# EAGLE design arduino-isp (EAGLE 7.7.0)
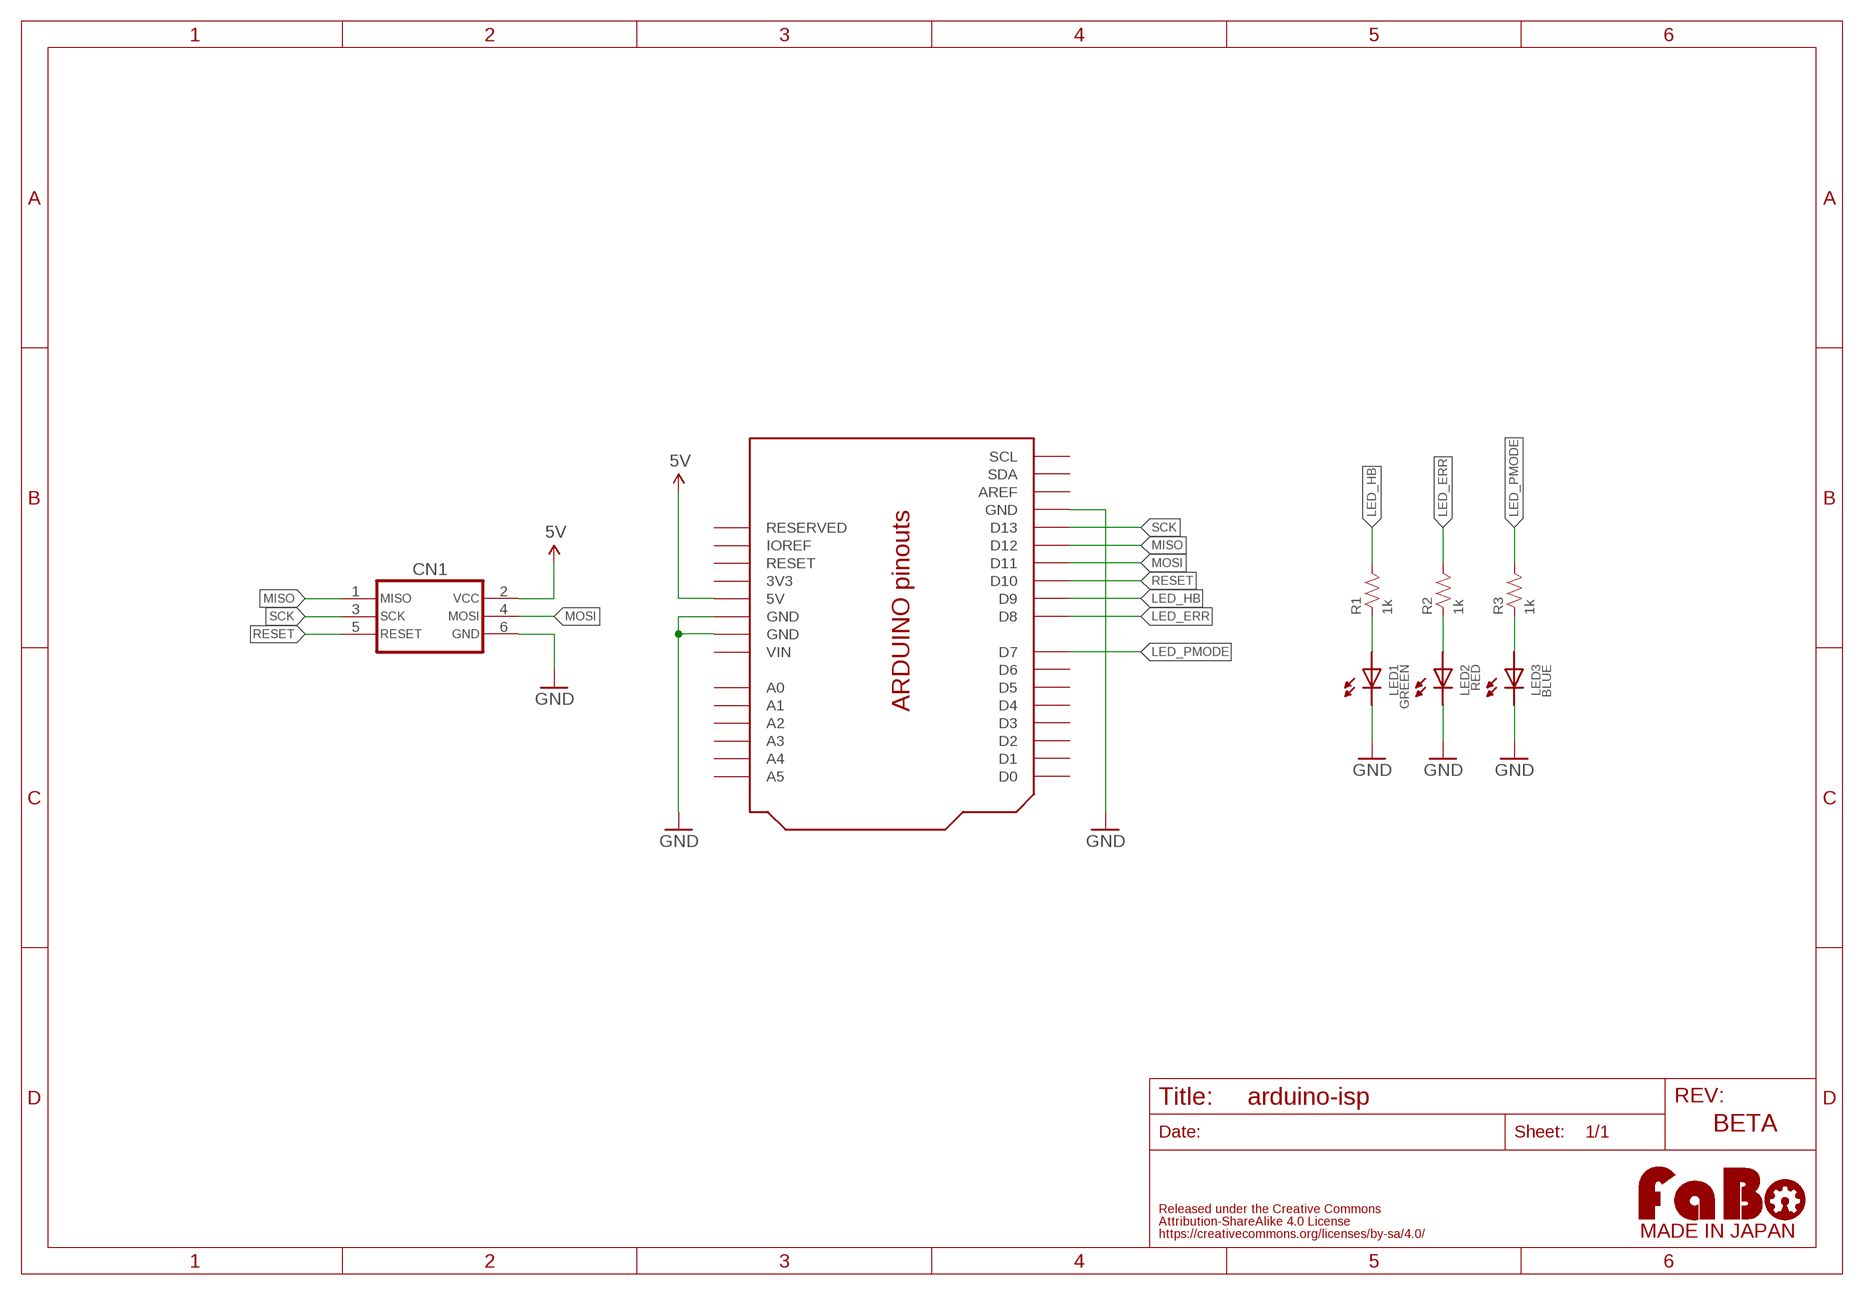
[diagram p0: schematic, sheet 1]

## Parts
CN1  AVR_ISP_BOX  [BOX_2X3]
LED1  GREEN  LED-5MM  [LED_5MM]
LED2  RED  LED-5MM  [LED_5MM]
LED3  BLUE  LED-5MM  [LED_5MM]
R1  1k  RESISTOR-AXL-REGULAR  [AXL-REGULAR]
R2  1k  RESISTOR-AXL-REGULAR  [AXL-REGULAR]
R3  1k  RESISTOR-AXL-REGULAR  [AXL-REGULAR]
U1  ARDUINO_UNO_R3_SHIELD-HALF  [ARDUINO_SHIELD_HALF]
U$2  LOGO_FABO-M  [LOGO_FABO_MS]

## Nets
5V: CN1.2 U1.5V
GND: CN1.6 LED1.K(CATHODE) LED2.K(CATHODE) LED3.K(CATHODE) U1.GND1(GND) U1.GND2(GND) U1.GND3(GND)
LED_ERR: R2.2 U1.D8
LED_HB: R1.2 U1.D9
LED_PMODE: R3.2 U1.D7
MISO: CN1.1 U1.D12
MOSI: CN1.4 U1.D11
N$2: LED1.A(ANODE) R1.1
N$4: LED2.A(ANODE) R2.1
N$6: LED3.A(ANODE) R3.1
RESET: CN1.5 U1.D10
SCK: CN1.3 U1.D13
Unconnected: U1.A0 U1.A1 U1.A2 U1.A3 U1.A4 U1.A5 U1.AREF U1.D0 U1.D1 U1.D2 U1.D3 U1.D4 U1.D5 U1.D6 U1.IOREF U1.RESERVED U1.RESET U1.SCL U1.SDA

## Notes on the sheet
- BETA

## Power pins joined to a net without a drawn wire
3V3: U1.3V3
VIN: U1.VIN

## Library data of the parts
CN1 = FaBo-PIN:AVR_ISP_BOX
LED1-LED3 = FaBo-LED:LED
R1-R3 = FaBo-Resistors:RESISTOR: RESISTOR
U1 = FaBo-Boards:ARDUINO_UNO_R3_SHIELD
U$2 = FaBo-Logo:LOGO_FABO

## Board
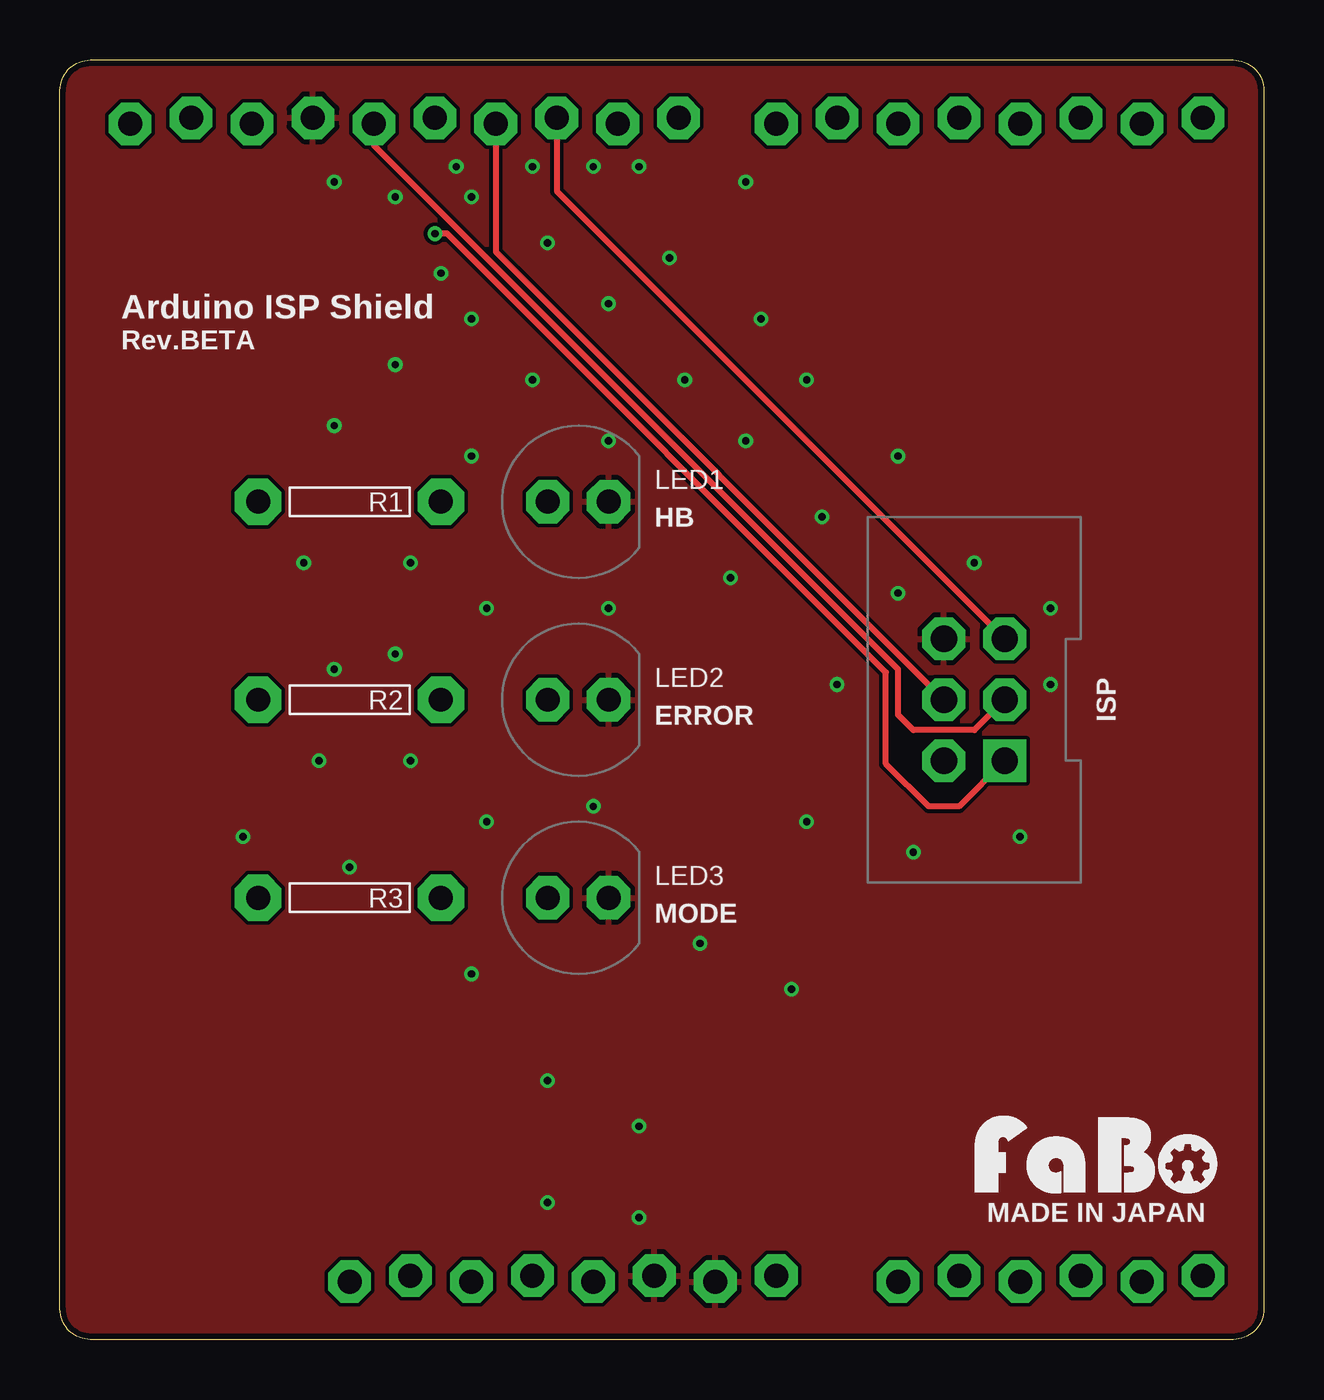
[diagram p1: board, top side]
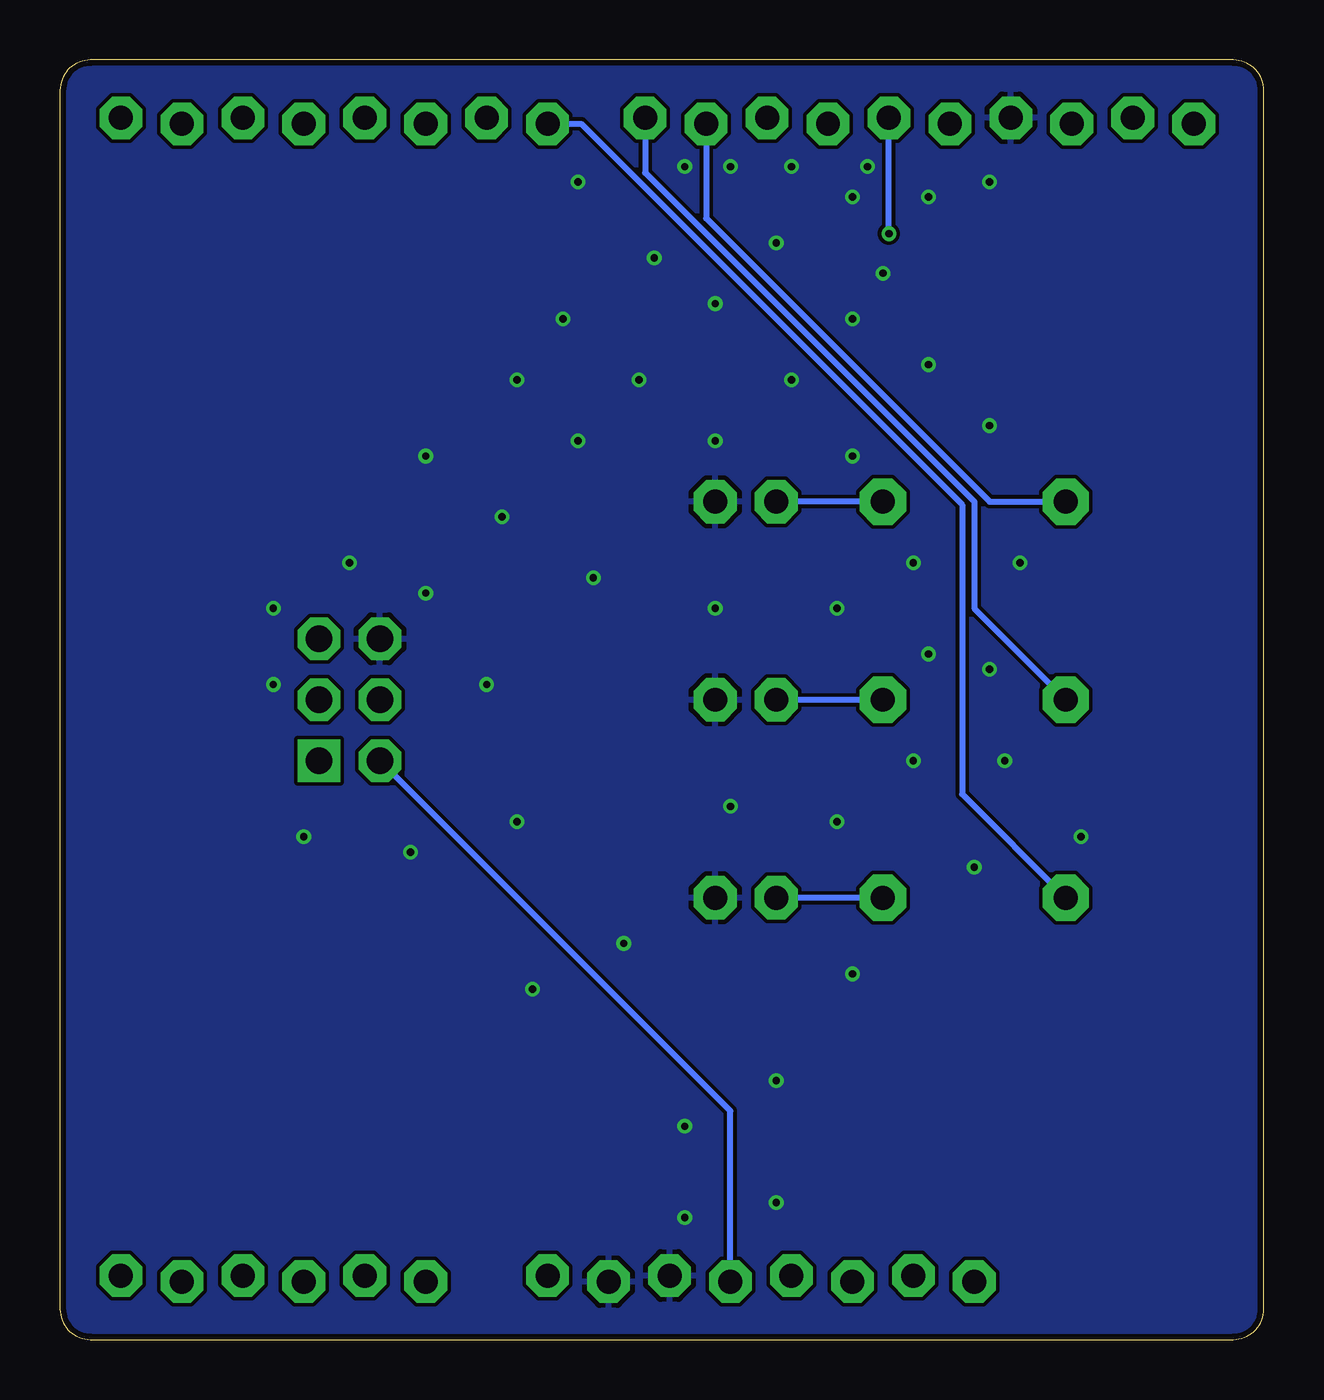
[diagram p2: board, bottom side, seen from below]

Size 50.16 x 53.34 mm. Coordinates in mm from the lower left corner, seen from the top.
Copper layers (1*16): Top 0.035mm / dielectric 1.6mm / Bottom 0.035mm
Design rules "PCBway": minimum track width 6mil, minimum drill 12mil, track to track 6mil, track to pad 6mil, pad to pad 6mil, via to via 6mil, smd to smd 6mil, copper to edge 10mil, drill to drill 10mil, minimum pad ring 10mil, minimum via ring 6mil, stop-mask expansion 2mil, vias tented up to drill 100mil, thermal gap 8mil

### Footprints (pad centres in the part's own frame; a part is rotated, then mirrored left to right if it is on the bottom)
BOX_2X3 = drill 1.1 pad 1.778 square: 1 -2.54,-1.27 | drill 1.1 pad 1.778 octagon: 2 -2.54,1.27; 3 0,-1.27; 4 0,1.27; 5 2.54,-1.27; 6 2.54,1.27
LED_5MM = drill 1 pad 1.8 octagon: A -1.27,0; K 1.27,0
AXL-REGULAR = drill 1 pad 1.93 octagon: 1 -3.81,0; 2 3.81,0
ARDUINO_SHIELD_HALF = drill 1 pad 1.778 octagon: 3V3 19.685,2.667; 5V 22.225,2.413; A0 34.925,2.413; A1 37.465,2.667; A2 40.005,2.413; A3 42.545,2.667; A4 45.085,2.413; A5 47.625,2.667; AREF 8.001,50.673; D0 47.625,50.927; D1 45.085,50.673; D2 42.545,50.927; D3 40.005,50.673; D4 37.465,50.927; D5 34.925,50.673; D6 32.385,50.927; D7 29.845,50.673; D8 25.781,50.927; D9 23.241,50.673; D10 20.701,50.927; D11 18.161,50.673; D12 15.621,50.927; D13 13.081,50.673; GND1 27.305,2.413; GND2 24.765,2.667; GND3 10.541,50.927; IOREF 14.605,2.667; RESERVED 12.065,2.413; RESET 17.145,2.413; SCL 2.921,50.673; SDA 5.461,50.927; VIN 29.845,2.667

### Placement (x,y rotation side)
CN1  38.1,26.67 90 top
LED1  21.59,34.92 0 top
LED2  21.59,26.67 0 top
LED3  21.59,18.41 0 top
R1  12.06,34.92 180 top
R2  12.06,26.67 180 top
R3  12.06,18.41 180 top
U1  0,0 0 top
U$2  43.18,5.71 0 top

### Tracks (layer width: path | path; a pad name or v marks a point on that pad's centre or on a via)
5V
  Bottom 0.254: U1.5V 22.23,9.53 CN1.2
GND  (via drill 0.3)
  other vias: 17.14,47.62 34.92,31.11 28.57,37.47 25.4,45.09 22.86,43.18 20.32,45.72 19.68,40.01 17.14,42.55 11.43,38.1 17.14,36.83 31.75,34.29 26.04,40.01 31.11,40.01 29.21,42.55 34.92,36.83 38.1,32.38 32.38,27.3 27.94,31.75 22.86,37.47 13.97,40.64 14.61,32.38 10.16,32.38 11.43,27.94 13.97,28.57 14.61,24.13 10.79,24.13 12.06,19.68 7.62,20.95 22.23,22.23 22.86,30.48 31.11,21.59 35.56,20.32 40.01,20.95 41.27,27.3 41.27,30.48 30.48,14.61 26.67,16.51 24.13,8.89 20.32,10.79 20.32,5.71 24.13,5.08 28.57,48.26 24.13,48.9 22.23,48.9 19.68,48.9 16.51,48.9 13.97,47.62 11.43,48.26 15.88,44.45 17.14,15.24 17.78,21.59 17.78,30.48
  pour Bottom: 0,0 50.16,0 50.16,53.34 0,53.34
  pour Top: 0,0 50.16,0 50.16,53.34 0,53.34
LED_ERR
  Bottom 0.254: U1.D8 25.78,48.64 12.06,34.92 12.06,30.48 R2.2
LED_HB
  Bottom 0.254: U1.D9 23.24,46.74 11.43,34.92 R1.2
LED_PMODE
  Bottom 0.254: U1.D7 28.45,50.67 12.57,34.8 12.57,22.73 R3.2
MISO  (via drill 0.3)
  Top 0.254: CN1.1 37.47,22.23 36.2,22.23 34.42,24 34.42,27.81 16.13,46.1 v15.62,46.1
  Bottom 0.254: v15.62,46.1 U1.D12
MOSI
  Top 0.254: U1.D11 18.16,45.34 CN1.4
N$2
  Bottom 0.254: R1.1 LED1.A
N$4
  Bottom 0.254: R2.1 LED2.A
N$6
  Bottom 0.254: R3.1 LED3.A
RESET
  Top 0.254: U1.D10 20.7,47.88 CN1.5
SCK
  Top 0.254: U1.D13 13.08,49.78 34.92,27.94 34.92,26.04 35.56,25.4 38.1,25.4 CN1.3

### Text on the board
tPlace: Arduino ISP Shield | Rev.BETA | HB | ISP | ERROR | MODE | MADE IN JAPAN